# Altium schematic sheet Power.SchDoc
size A4
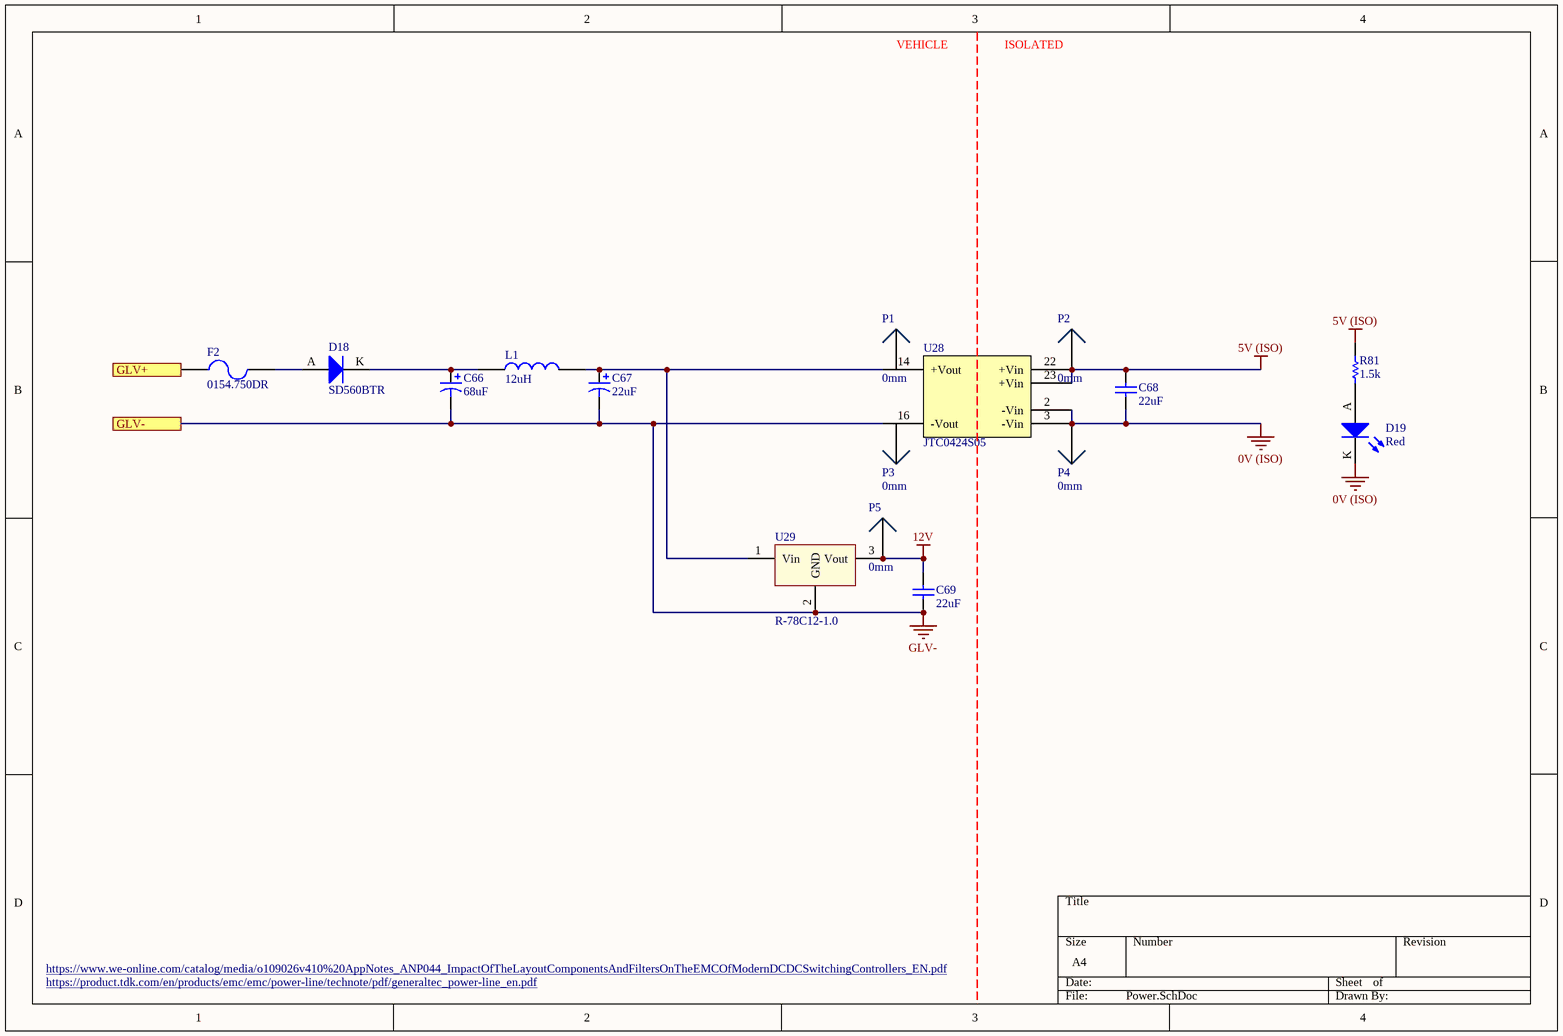
[diagram p0: Power.SchDoc]

## Parts
C66  68uF  [2924]
C67  22uF  [2924]
C68  22uF  [1206]
C69  22uF  [1206]
D18  SD560BTR  [SMB Diode]
D19  Red  [0805 LED]
F2  0154.750DR  [Omni BLOK 0154]
L1  12uH  [1812]
P1  0mm  [TH Test Point]
P2  0mm  [TH Test Point]
P3  0mm  [TH Test Point]
P4  0mm  [TH Test Point]
P5  0mm  [TH Test Point]
R81  1.5k  [0805]
U28  JTC0424S05  [24-DIP Module, 7 Leads]
U29  R-78C12-1.0  [RECOM 3-SIP]

## Ports
GLV+, GLV-

## Nets
0V (ISO): C68.1 D19.K P4.1 U28.2(-Vin) U28.3(-Vin)
5V (ISO): C68.2 P2.1 R81.2 U28.22(+Vin) U28.23(+Vin)
12V: C69.2 P5.1 U29.3(Vout)
GLV-: C66.1 C67.1 C69.1 U28.16(-Vout) U29.2(GND) ; port GLV-
GLV+: F2.1 ; port GLV+
NetC66_2: C66.2 D18.K L1.2
NetC67_2: C67.2 L1.1 U28.14(+Vout) U29.1(Vin)
NetD18_A: D18.A F2.2
NetD19_A: D19.A R81.1

Not connected (* = marked no-connect by the designer): P1 1; P3 1

## Notes on the sheet
- VEHICLE
- ISOLATED
- https://www.we-online.com/catalog/media/o109026v410%20AppNotes_ANP044_ImpactOfTheLayoutComponentsAndFiltersOnTheEMCOfModernDCDCSwitchingControllers_EN.pdf
- https://product.tdk.com/en/products/emc/emc/power-line/technote/pdf/generaltec_power-line_en.pdf

## Library data of the parts
C66 = TAJV686K035RNJ: Manufacturer: AVX Corporation; Tolerance: 10%; Material: Tantalum; Rated Voltage: 35V; Part Number: TAJV686K035RNJ; Value: 68uF; Digikey Part Number: 478-13135-1-ND
C67 = TAJV226K050RNJ: Manufacturer: AVX Corporation; Tolerance: 10%; Material: Tantalum; Rated Voltage: 50V; Part Number: TAJV226K050RNJ; Value: 22uF; Digikey Part Number: 478-5811-1-ND
C68 C69 = CC1206MKX5R7BB226: Manufacturer: YAGEO; Tolerance: 20%; Material: Ceramic; Rated Voltage: 16V; Part Number: CC1206MKX5R7BB226; Value: 22uF; Digikey Part Number: 311-1997-2-ND
D18 = SD560BTR: 1.2V_F 600V 5A SMB; Manufacturer: SMC Diode Solutions; Part Number: SD560BTR; Digikey Part Number: 1655-1530-2-ND; Digikey Link: https://www.digikey.com/product-detail/en/smc-diode-solutions/SD560BTR/1655-1530-2-ND/6022620
D19 = SML-210LTT86: Red LED Indication - Discrete 1.75V 0805 (2012 Metric); Manufacturer: ROHM Semiconductor; Part Number: SML-210LTT86; Colour: Red; Digikey Part Number: 511-1286-1-ND; Digikey Link: https://www.digikey.com/product-detail/en/rohm-semiconductor/SML-210LTT86/511-1286-1-ND/637099
F2 = 0154.750DR: FUSE BOARD MNT 750MA 125VAC/VDC; Manufacturer: LittelFuse Inc; Part Number: 0154.750DR; Digikey Part Number: F1221CT-ND; Digikey Link: https://www.digikey.com/product-detail/en/littelfuse-inc/0154.750DR/F1221CT-ND/183370
L1 = RLS-126: Manufacturer: Recom; Impedence: 230mOhm; Tolerance: 0.2; Material: Wirewound; Rated Current: 800mA; Part Number: RLS-126; Inductance: 12uH; Digikey Part Number: 945-3429-ND
P1-P5 = TH Test Point: Positions: 1; Angle: 0; Flange: No; Contact: NA; Part Number: TH Test Point; Pitch: 0mm; Row Spacing: 0mm
R81 = RC0805FR071K5L: Manufacturer: YAGEO; Tolerance: 0.01; Rated Voltage: 0.125W; Part Number: RC0805FR071K5L; Value: 1.5k; Material: FR-07
U28 = JTC0424S05: DC DC CONVERTER 5V 4W; Manufacturer: XP Power; Input Voltage: 9V-36V; Efficiency: 0.79; Isolation: Isolated; Part Number: JTC0424S05; Output Voltage: 5V; Output Power: 4W; Digikey Part Number: JTC0424S05-ND; Digikey Link: https://www.digikey.com/products/en?keywords=%20JTC0424S05
U29 = R-78C12-1.0: 3PIN DC DC CONVERTER 12V 12W; Manufacturer: Recom; Isolation: Non-Isolated; Part Number: R-78C12-1.0; Digikey Part Number: 945-1392-5-ND; Digikey Link: https://www.digikey.com/products/en/power-supplies-board-mount/dc-dc-converters/922?k=R-78C&k=&pkeyword=R-78C&sv=0&pv1525=44&sf=0&FV=ffe0039a&quantity=&ColumnSort=0&page=1&pageSize=25